# Altium schematic sheet INV.SchDoc
size A1; SheetNumber: 5; SheetTotal: 5
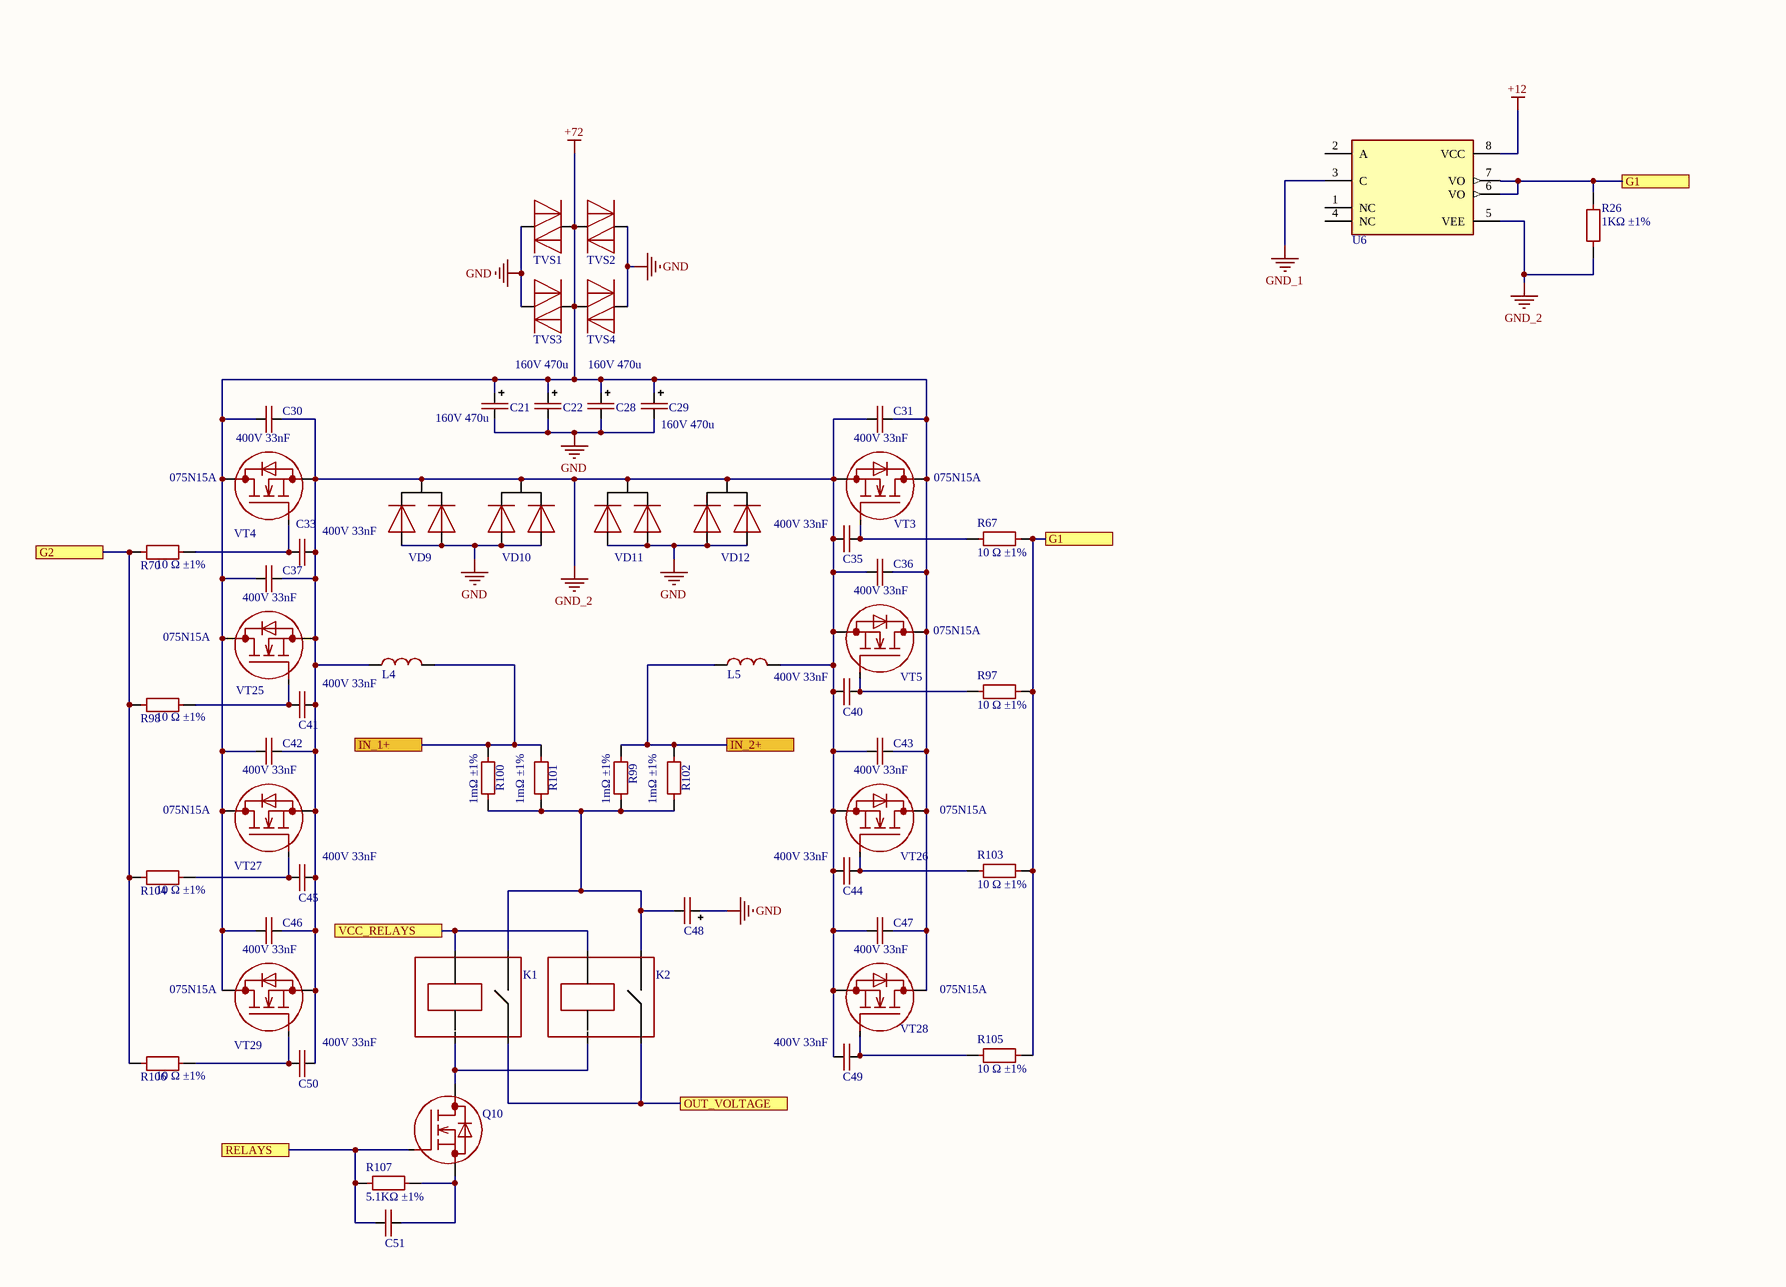
[diagram p0: INV.SchDoc, left]
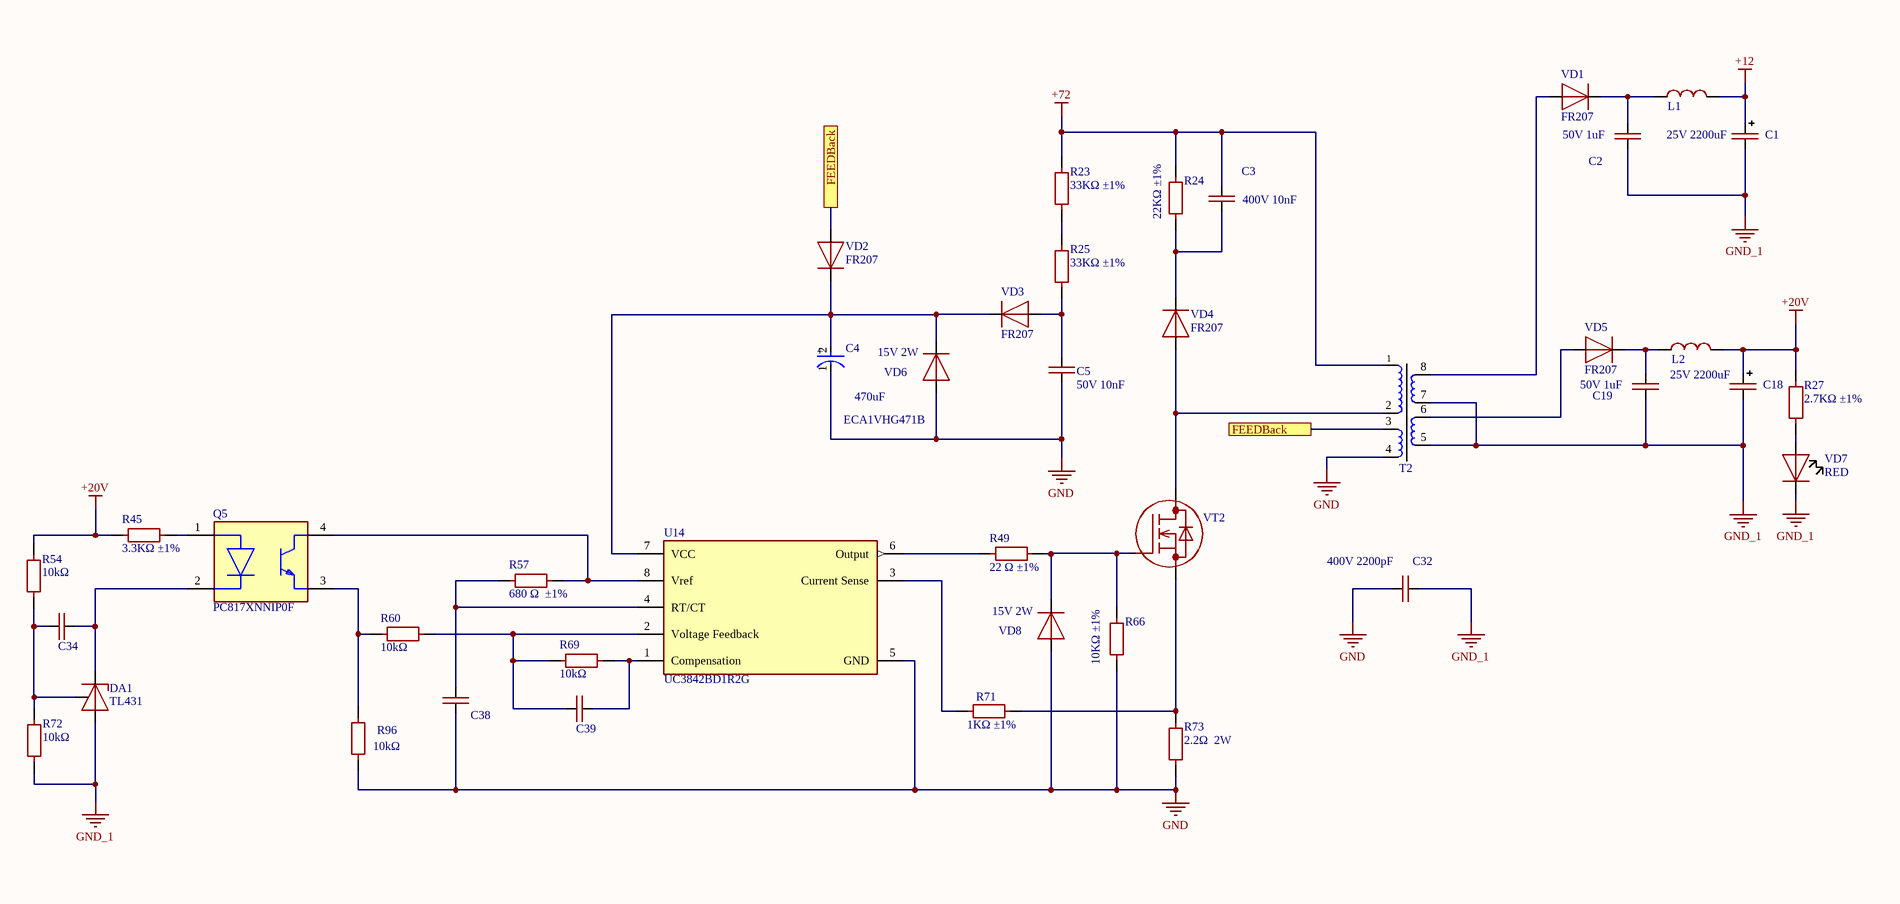
[diagram p1: INV.SchDoc, right]

## Parts
C1  value 25V 2200uF  [CAPPOL-12x25]  (hidden comment: CAP-POLAR)
C2  value 50V 1uF  [CAP-0603]  (hidden comment: CAP-NON-POLAR)
C3  value 400V 10nF  [CAP-V5]  (hidden comment: CAP-NON-POLAR)
C4  ECA1VHG471B  Capacitance: 470uF  [FP-RAD-TH-D_10_0_5-L_16_1-MFG]
C5  50V 10nF  [CAP-0805]
C18  value 25V 2200uF  [CAPPOL-12x25]  (hidden comment: CAP-POLAR)
C19  value 50V 1uF  [CAP-0603]  (hidden comment: CAP-NON-POLAR)
C21  value 160V 470u  [CAPPOL-18x40]  (hidden comment: CAP-POLAR)
C22  value 160V 470u  [CAPPOL-18x40]  (hidden comment: CAP-POLAR)
C28  value 160V 470u  [CAPPOL-18x40]  (hidden comment: CAP-POLAR)
C29  value 160V 470u  [CAPPOL-18x40]  (hidden comment: CAP-POLAR)
C30  value 400V 33nF  [CAP-1206]  (hidden comment: CAP-NON-POLAR)
C31  value 400V 33nF  [CAP-1206]  (hidden comment: CAP-NON-POLAR)
C32  value 400V 2200pF  [CAP-V5]  (hidden comment: CAP-NON-POLAR)
C33  value 400V 33nF  [CAP-1206]  (hidden comment: CAP-NON-POLAR)
C34  CAP-NON-POLAR  [KEMET_C0805C-DN_IPC_B]  (value not drawn)
C35  value 400V 33nF  [CAP-1206]  (hidden comment: CAP-NON-POLAR)
C36  value 400V 33nF  [CAP-1206]  (hidden comment: CAP-NON-POLAR)
C37  value 400V 33nF  [CAP-1206]  (hidden comment: CAP-NON-POLAR)
C38  CAP-NON-POLAR  [CAP-0603]  (value not drawn)
C39  CAP-NON-POLAR  [KEMET_C0805C-DN_IPC_B]  (value not drawn)
C40  value 400V 33nF  [CAP-1206]  (hidden comment: CAP-NON-POLAR)
C41  value 400V 33nF  [CAP-1206]  (hidden comment: CAP-NON-POLAR)
C42  value 400V 33nF  [CAP-1206]  (hidden comment: CAP-NON-POLAR)
C43  value 400V 33nF  [CAP-1206]  (hidden comment: CAP-NON-POLAR)
C44  value 400V 33nF  [CAP-1206]  (hidden comment: CAP-NON-POLAR)
C45  value 400V 33nF  [CAP-1206]  (hidden comment: CAP-NON-POLAR)
C46  value 400V 33nF  [CAP-1206]  (hidden comment: CAP-NON-POLAR)
C47  value 400V 33nF  [CAP-1206]  (hidden comment: CAP-NON-POLAR)
C48  CAP-POLAR  [CAP 330uF 450V]  (value not drawn)
C49  value 400V 33nF  [CAP-1206]  (hidden comment: CAP-NON-POLAR)
C50  value 400V 33nF  [CAP-1206]  (hidden comment: CAP-NON-POLAR)
C51  CAP-NON-POLAR  [CAP-0603]  (value not drawn)
DA1  TL431  [SOT23-3]
K1  RELAY  [HFV7-P]  (value not drawn)
K2  RELAY  [HFV7-P]  (value not drawn)
L1  IND-CONST  [IND-7850]  (value not drawn)
L2  IND-CONST  [IND-7850]  (value not drawn)
L4  IND-CONST  (value not drawn)
L5  IND-CONST  (value not drawn)
Q5  PC817XNNIP0F  [FP-PC817XNNIP0F-MFG]
Q10  MOSFET-N-GDS  [SOT-223-3]  (value not drawn)
R23  value 33KΩ ±1%  [RES-1206]  (hidden comment: RES-CONST)
R24  value 22KΩ ±1%  [RES-1206]  (hidden comment: RES-CONST)
R25  value 33KΩ ±1%  [RES-1206]  (hidden comment: RES-CONST)
R26  value 1KΩ ±1%  [RES-0603]  (hidden comment: RES-CONST)
R27  value 2.7KΩ ±1%  [RES-0603]  (hidden comment: RES-CONST)
R45  value 3.3KΩ ±1%  [Vishay_CRCW0805-e3_IPC_A]  (hidden comment: RES-CONST)
R49  value 22 Ω ±1%  [RES-0603]  (hidden comment: RES-CONST)
R54  10kΩ  [Vishay_CRCW0805-e3_IPC_A]
R57  value 680 Ω  ±1%  [RES-0603]  (hidden comment: RES-CONST)
R60  10kΩ  [Vishay_CRCW0805-e3_IPC_A]
R66  value 10KΩ ±1%  [RES-0603]  (hidden comment: RES-CONST)
R67  10 Ω ±1%  [RES-0603]
R69  10kΩ  [Vishay_CRCW0805-e3_IPC_A]
R70  10 Ω ±1%  [RES-0603]
R71  value 1KΩ ±1%  [RES-0603]  (hidden comment: RES-CONST)
R72  10kΩ  [Vishay_CRCW0805-e3_IPC_A]
R73  value 2.2Ω  2W  [RES-2W]  (hidden comment: RES-CONST)
R96  10kΩ  [RES-0603]
R97  10 Ω ±1%  [RES-0603]
R98  10 Ω ±1%  [RES-0603]
R99  value 1mΩ ±1%  [RES-3921]  (hidden comment: RES-CONST)
R100  value 1mΩ ±1%  [RES-3921]  (hidden comment: RES-CONST)
R101  value 1mΩ ±1%  [RES-3921]  (hidden comment: RES-CONST)
R102  value 1mΩ ±1%  [RES-3921]  (hidden comment: RES-CONST)
R103  10 Ω ±1%  [RES-0603]
R104  10 Ω ±1%  [RES-0603]
R105  10 Ω ±1%  [RES-0603]
R106  10 Ω ±1%  [RES-0603]
R107  value 5.1KΩ ±1%  [RES-0603]  (hidden comment: RES-CONST)
T2  TRANS_RM6  [TRANS_RM6]  (value not drawn)
TVS1  DIODE-3  [DO-214AB]  (value not drawn)
TVS2  DIODE-3  [DO-214AB]  (value not drawn)
TVS3  DIODE-3  [DO-214AB]  (value not drawn)
TVS4  DIODE-3  [DO-214AB]  (value not drawn)
U6  HCPL-3120  [SOP-8]  (value not drawn)
U14  UC3842BD1R2G  [FP-751-07-MFG]
VD1  FR207  [FR207]
VD2  FR207  [FR207]
VD3  FR207  [FR207]
VD4  FR207  [FR207]
VD5  FR207  [FR207]
VD6  value 15V 2W  [DO-35]  (hidden comment: DIODE)
VD7  value RED  [LED-0603]  (hidden comment: LED)
VD8  value 15V 2W  [DO-35]  (hidden comment: DIODE)
VD9  DIODE-2  [TO-247-3]  (value not drawn)
VD10  DIODE-2  [TO-247-3]  (value not drawn)
VD11  DIODE-2  [TO-247-3]  (value not drawn)
VD12  DIODE-2  [TO-247-3]  (value not drawn)
VT2  MOSFET-N-GDS  [TO-220(bend2)]  (value not drawn)
VT3  value 075N15A  [TO-220-3]  (hidden comment: MOSFET-N-GDS)
VT4  value 075N15A  [TO-220-3]  (hidden comment: MOSFET-N-GDS)
VT5  value 075N15A  [TO-220-3]  (hidden comment: MOSFET-N-GDS)
VT25  value 075N15A  [TO-220-3]  (hidden comment: MOSFET-N-GDS)
VT26  value 075N15A  [TO-220-3]  (hidden comment: MOSFET-N-GDS)
VT27  value 075N15A  [TO-220-3]  (hidden comment: MOSFET-N-GDS)
VT28  value 075N15A  [TO-220-3]  (hidden comment: MOSFET-N-GDS)
VT29  value 075N15A  [TO-220-3]  (hidden comment: MOSFET-N-GDS)

## Ports
FEEDBack, G1, G2, IN_1+, IN_2+, OUT_VOLTAGE, RELAYS, VCC_RELAYS

## Nets
+12: C1.1(+) L1.2 U6.8(VCC)
+20V: C18.1(+) L2.2 R27.2 R45.1 R54.1
+72: C3.2 C21.1(+) C22.1(+) C28.1(+) C29.1(+) C30.1 C31.2 C36.2 C37.1 C42.1 C43.2 C46.1 C47.2 R23.1 R24.2 T2.1 TVS1.2(A) TVS2.1(C) TVS3.2(A) TVS4.1(C) VT3.2(D) VT4.2(D) VT5.2(D) VT25.2(D) VT26.2(D) VT27.2(D) VT28.2(D) VT29.2(D)
GND: C4.1(C) C5.2 C21.2(-) C22.2(-) C28.2(-) C29.2(-) C32.2 C38.1 C48.1(+) R66.1 R73.1 R96.1 T2.4 TVS1.1(C) TVS2.2(A) TVS3.1(C) TVS4.2(A) U14.5(GND) VD6.2(A) VD8.2(A) VD9.1(A) VD9.3(A) VD10.1(A) VD10.3(A) VD11.1(A) VD11.3(A) VD12.1(A) VD12.3(A)
GND_1: C1.2(-) C2.1 C18.2(-) C19.1 C32.1 DA1.3(A) R72.2 T2.5 T2.7 U6.3(C) VD7.1(C)
GND_2: C30.2 C31.1 C33.2 C35.1 C36.1 C37.2 C40.1 C41.2 C42.2 C43.1 C44.1 C45.2 C46.2 C47.1 C49.1 C50.2 L4.1 L5.1 R26.1 U6.5(VEE) VD9.2(C) VD10.2(C) VD11.2(C) VD12.2(C) VT3.3(S) VT4.3(S) VT5.3(S) VT25.3(S) VT26.3(S) VT27.3(S) VT28.3(S) VT29.3(S)
FEEDBack: T2.3 VD2.2(A) ; port FEEDBack
G1: R26.2 R67.1 R97.1 R103.1 R105.1 U6.6(VO) U6.7(VO) ; port G1
G2: R70.1 R98.1 R104.1 R106.1 ; port G2
IN_1+: L4.2 R100.2 R101.2 ; port IN_1+
IN_2+: L5.2 R99.2 R102.2 ; port IN_2+
OUT_VOLTAGE: K1.85 K2.85 ; port OUT_VOLTAGE
RELAYS: C51.1 Q10.1(G) R107.1 ; port RELAYS
VCC_RELAYS: K1.87 K2.87 ; port VCC_RELAYS
NetC2_2: C2.2 L1.1 VD1.1(C)
NetC3_1: C3.1 R24.1 VD4.1(C)
NetC4_2: C4.2(A) U14.7(VCC) VD2.1(C) VD3.1(C) VD6.1(C)
NetC5_1: C5.1 R25.2 VD3.2(A)
NetC19_2: C19.2 L2.1 VD5.1(C)
NetC33_1: C33.1 R70.2 VT4.1(G)
NetC34_1: C34.1 DA1.2(C) Q5.2(C)
NetC34_2: C34.2 DA1.1(REF) R54.2 R72.1
NetC35_2: C35.2 R67.2 VT3.1(G)
NetC38_2: C38.2 R57.2 U14.4(RT/CT)
NetC39_1: C39.1 R69.1 U14.1(Compensation)
NetC39_2: C39.2 R60.1 R69.2 U14.2(Voltage_Feedback)
NetC40_2: C40.2 R97.2 VT5.1(G)
NetC41_1: C41.1 R98.2 VT25.1(G)
NetC44_2: C44.2 R103.2 VT26.1(G)
NetC45_1: C45.1 R104.2 VT27.1(G)
NetC48_2: C48.2(-) K1.86 K2.86 R99.1 R100.1 R101.1 R102.1
NetC49_2: C49.2 R105.2 VT28.1(G)
NetC50_1: C50.1 R106.2 VT29.1(G)
NetC51_2: C51.2 Q10.3(S) R107.2
NetK1_30: K1.30 K2.30 Q10.2(D)
NetQ5_1: Q5.1(A) R45.2
NetQ5_3: Q5.3(E) R60.2 R96.2
NetQ5_4: Q5.4(C) R57.1 U14.8(Vref)
NetR23_2: R23.2 R25.1
NetR27_1: R27.1 VD7.2(A)
NetR49_1: R49.1 U14.6(Output)
NetR49_2: R49.2 R66.2 VD8.1(C) VT2.1(G)
NetR71_1: R71.1 U14.3(Current_Sense)
NetR71_2: R71.2 R73.2 VT2.3(S)
NetT2_2: T2.2 VD4.2(A) VT2.2(D)
NetT2_6: T2.6 VD5.2(A)
NetT2_8: T2.8 VD1.2(A)

Not connected (* = marked no-connect by the designer): U6 1(NC) 2(A) 4(NC)

## Notes on the sheet
- (in symbol CMP-05427-001499-1) +

## Library data of the parts
C1 C18 = 16: Part Number: 16; №: 16
C2 C19 = 2: Part Number: 2; №: 2
C3 C32 = 6: Part Number: 6; №: 6
C4 = CMP-05427-001499-1: Aluminum Electrolytic Capacitors (Radial Lead Type) AEC-Q200 Qualified 470uF ±20% 35V; Lead Diameter: 0.6mm; Lead/Base Style: Straight; Polarity: Polar; Life (Hours): 2000Hour; Ripple Current: 460mA; Tolerance: 20%; Termination: Radial; Contact Plating: Tin; Length: 16mm; Voltage Rating: 35V; Max Operating Temperature: 105°C; Construction: RADIAL; Voltage Rating (DC): 35V; Radiation Hardening: No; Packaging: Tape and Reel; Diameter: 10mm; Series: NHG; Case/Package: Radial; Mount: Through Hole; Lead Pitch: 5mm; Height: 16mm; RoHS Compliant: Yes; Height - Seated (Max): 0.669inch; Min Operating Temperature: -55°C; Package Quantity: 500
C5 = 17: Part Number: 17; Value: 50V 100nF; №: 17
C21 C22 C28 C29 = 1: №: 1; ID: C-0690; Part Number: 1
C30 C31 C33 C35-C37 C40-C47 C49-C51 = 5: Part Number: 5; ID: C-0694; №: 5
C34 C39 = CAP-NON-POLAR: Part Number: 2; Value: 50V 100nF; №: 2
C38 = 2: Part Number: 2; Value: 50V 100nF; №: 2
C48 = 12: Part Number: 12; Value: 80V 470uF; №: 12
DA1 = TL431: №: 9; ID: I-0009; Part Number: TL431; Value: TL431
K1 K2 = HFV7-P: №: 1; ID: E-0001; Value: 12VDC 70A; Part Number: HFV7-P
L1 L2 = 2: Part Number: 2; ID: L-0002; Value: 33; №: 2
L4 L5 = 1: №: 1; ID: L-0001; Part Number: 1
Q5 = CMP-65434-000005-1: OPTOISOLATOR 5KV TRANS 4SMD; Reverse Breakdown Voltage: 6V; Output Current per Channel: 30mA; Power Dissipation: 200mW; Collector-emitter Voltage-Max: 200mV; Max Output Voltage: 80V; Input Current: 50mA; Forward Voltage: 1.4V; Fall Time: 18000ns; Number of Elements: 1; Input Type: DC; Packaging: Tape and Reel; RoHS Compliant: Yes; Contact Plating: Copper; Min Operating Temperature: -30°C; Collector Emitter Saturation Voltage: 200mV; Max Input Current: 50mA; Radiation Hardening: No; Max Collector Current: 50mA; Case/Package: SMD/SMT; Mount: Surface Mount; Output Voltage: 80V; Forward Current: 50mA; Max Power Dissipation: 200mW; Collector Emitter Voltage (VCEO): 80V; Number of Channels: 1; Rise Time: 18000ns; Isolation Voltage: 5kV; Number of Pins: 4; Lead Free: Lead Free; Package Quantity: 2000; Isolation Voltage-Max: 5kV; Max Operating Temperature: 100°C
Q10 = AP9997GK: №: 4; ID: T-0004; Value: 100V 3.2A; Part Number: AP9997GK
R23 R25 = 206: Part Number: 206; ID: R-0206; №: 206
R24 = 207: Part Number: 207; ID: R-0207; №: 207
R26 R71 = 37: Part Number: 37; ID: R-0037; №: 37
R27 = 39: Part Number: 39; ID: R-0039; №: 39
R45 = RES-CONST: Part Number: 40; ID: R-0040; №: 40
R49 = 2: Part Number: 2; ID: R-0002; №: 2
R54 R60 R69 R72 R96 = RES-CONST: Part Number: 22; ID: R-0022; №: 22
R57 = 33: Part Number: 33; ID: R-0033; №: 33
R66 = 50: Part Number: 50; ID: R-0050; №: 50
R67 R70 R97 R98 R103-R106 = 1: №: 1; ID: R-0001; Part Number: 1; Value: 10 Ω ±1%
R73 = 205: Part Number: 205; ID: R-0205; №: 205
R99-R102 = PU3921FKMP90R001L: №: 199; ID: R-0199; Part Number: PU3921FKMP90R001L
R107 = 43: Part Number: 43; ID: R-0043; №: 43
T2 = 4: №: 4; Value: XX; Part Number: 4
TVS1-TVS4 = SMCJ150CA: №: 2; ID: D-0002; Value: TVS 200v; Part Number: SMCJ150CA
U14 = CMP-00278-00875370-1: UC3842BD1R2G UC3842B Series 30 V 275 kHz High Performance Current Mode Controller - SOIC-8; NexarPartId: 875370; Manufacturer Lifecycle Status: ACTIVE; Max Power Dissipation: 702mW; Max Supply Current: 17mA; Number of Channels: 1; Switching Frequency: 52kHz; Max Supply Voltage: 30V; Max Junction Temperature (Tj): 150°C; Max Duty Cycle: 96%; Output Current: 1A; Rise Time: 50ns; Output Voltage: 5.1V; Max Frequency: 275kHz; Topology: Flyback, Boost; Packaging: Cut Tape (CT); Max Operating Temperature: 70°C; Lifecycle Status: Production; Length: 5mm; Case/Package: SOIC; Schedule B: 8542390000, 8542390000; Number of Pins: 8; RoHS: Compliant; Frequency: 52kHz; Number of Outputs: 1; Width: 4mm; Halogen Free: Halogen Free; Height: 1.5mm; Radiation Hardening: No; Ambient Temperature Range High: 70°C; Duty Cycle: 96%; Lead Free: Lead Free; Min Operating Temperature: 0°C; Mount: Surface Mount; Fall Time: 50ns
VD1-VD5 = FR207: №: 12; ID: D-0754; Value: 1000V 2A; Part Number: FR207
VD6 VD8 = BZX55C15V: №: 13; ID: D-0755; Part Number: BZX55C15V
VD7 = 2: Part Number: 2; ID: O-0002; №: 2
VD9-VD12 = 80CPU02: №: 1; ID: D-0743; Value: 200V 40A; Part Number: 80CPU02
VT2 = IRF640_: №: 8; ID: T-0008; Value: 200V 18A; Part Number: IRF640_
VT3-VT5 VT25-VT29 = 075N15A: №: 1; ID: T-0001; Part Number: 075N15A